# Altium schematic sheet DDR.SchDoc
size A4; SheetNumber: 3; SheetTotal: 9
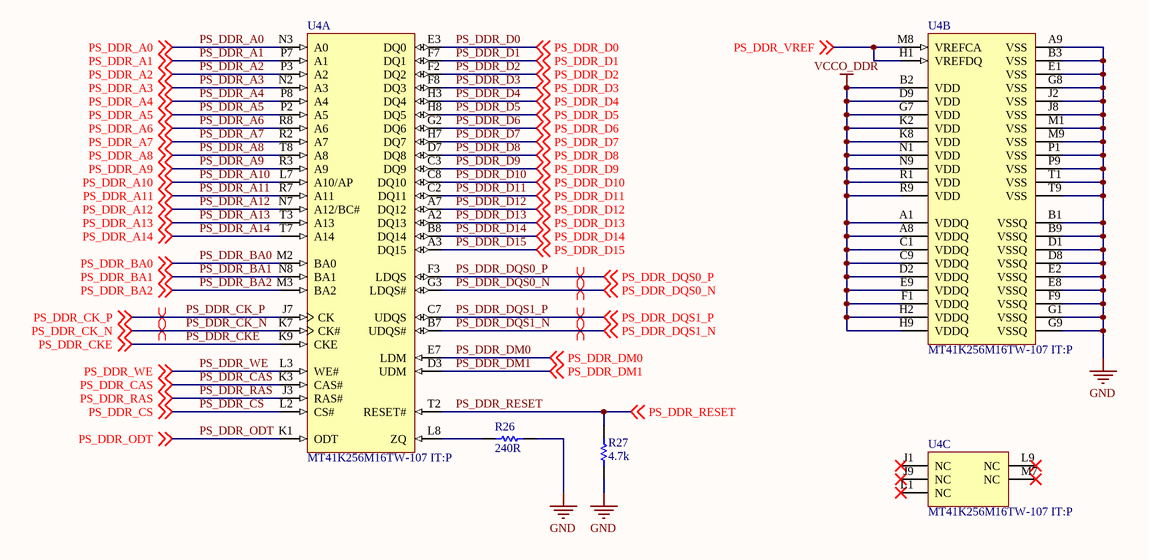
[diagram p0: DDR.SchDoc]

## Parts
R26  240R  [RESC0603(1608)_N]
R27  4.7k  [RESC1608X55X25LL10T15]
U4  MT41K256M16TW-107 IT:P  [MICT-TW-96]  (parts A,B,C of 3)

## Nets
GND: R26.2 R27.1 U4.A9(VSS) U4.B1(VSSQ) U4.B3(VSS) U4.B9(VSSQ) U4.D1(VSSQ) U4.D8(VSSQ) U4.E1(VSS) U4.E2(VSSQ) U4.E8(VSSQ) U4.F9(VSSQ) U4.G1(VSSQ) U4.G8(VSS) U4.G9(VSSQ) U4.J2(VSS) U4.J8(VSS) U4.M1(VSS) U4.M9(VSS) U4.P1(VSS) U4.P9(VSS) U4.T1(VSS) U4.T9(VSS)
VCCO_DDR: U4.A1(VDDQ) U4.A8(VDDQ) U4.B2(VDD) U4.C1(VDDQ) U4.C9(VDDQ) U4.D2(VDDQ) U4.D9(VDD) U4.E9(VDDQ) U4.F1(VDDQ) U4.G7(VDD) U4.H2(VDDQ) U4.H9(VDDQ) U4.K2(VDD) U4.K8(VDD) U4.N1(VDD) U4.N9(VDD) U4.R1(VDD) U4.R9(VDD)
PS_DDR_A0: U4.N3(A0) ; off-sheet PS_DDR_A0
PS_DDR_A1: U4.P7(A1) ; off-sheet PS_DDR_A1
PS_DDR_A2: U4.P3(A2) ; off-sheet PS_DDR_A2
PS_DDR_A3: U4.N2(A3) ; off-sheet PS_DDR_A3
PS_DDR_A4: U4.P8(A4) ; off-sheet PS_DDR_A4
PS_DDR_A5: U4.P2(A5) ; off-sheet PS_DDR_A5
PS_DDR_A6: U4.R8(A6) ; off-sheet PS_DDR_A6
PS_DDR_A7: U4.R2(A7) ; off-sheet PS_DDR_A7
PS_DDR_A8: U4.T8(A8) ; off-sheet PS_DDR_A8
PS_DDR_A9: U4.R3(A9) ; off-sheet PS_DDR_A9
PS_DDR_A10: U4.L7(A10/AP) ; off-sheet PS_DDR_A10
PS_DDR_A11: U4.R7(A11) ; off-sheet PS_DDR_A11
PS_DDR_A12: U4.N7(A12/BC#) ; off-sheet PS_DDR_A12
PS_DDR_A13: U4.T3(A13) ; off-sheet PS_DDR_A13
PS_DDR_A14: U4.T7(A14) ; off-sheet PS_DDR_A14
PS_DDR_BA0: U4.M2(BA0) ; off-sheet PS_DDR_BA0
PS_DDR_BA1: U4.N8(BA1) ; off-sheet PS_DDR_BA1
PS_DDR_BA2: U4.M3(BA2) ; off-sheet PS_DDR_BA2
PS_DDR_CAS: U4.K3(CAS#) ; off-sheet PS_DDR_CAS
PS_DDR_CK_N: U4.K7(CK#) ; off-sheet PS_DDR_CK_N
PS_DDR_CK_P: U4.J7(CK) ; off-sheet PS_DDR_CK_P
PS_DDR_CKE: U4.K9(CKE) ; off-sheet PS_DDR_CKE
PS_DDR_CS: U4.L2(CS#) ; off-sheet PS_DDR_CS
PS_DDR_D0: U4.E3(DQ0) ; off-sheet PS_DDR_D0
PS_DDR_D1: U4.F7(DQ1) ; off-sheet PS_DDR_D1
PS_DDR_D2: U4.F2(DQ2) ; off-sheet PS_DDR_D2
PS_DDR_D3: U4.F8(DQ3) ; off-sheet PS_DDR_D3
PS_DDR_D4: U4.H3(DQ4) ; off-sheet PS_DDR_D4
PS_DDR_D5: U4.H8(DQ5) ; off-sheet PS_DDR_D5
PS_DDR_D6: U4.G2(DQ6) ; off-sheet PS_DDR_D6
PS_DDR_D7: U4.H7(DQ7) ; off-sheet PS_DDR_D7
PS_DDR_D8: U4.D7(DQ8) ; off-sheet PS_DDR_D8
PS_DDR_D9: U4.C3(DQ9) ; off-sheet PS_DDR_D9
PS_DDR_D10: U4.C8(DQ10) ; off-sheet PS_DDR_D10
PS_DDR_D11: U4.C2(DQ11) ; off-sheet PS_DDR_D11
PS_DDR_D12: U4.A7(DQ12) ; off-sheet PS_DDR_D12
PS_DDR_D13: U4.A2(DQ13) ; off-sheet PS_DDR_D13
PS_DDR_D14: U4.B8(DQ14) ; off-sheet PS_DDR_D14
PS_DDR_D15: U4.A3(DQ15) ; off-sheet PS_DDR_D15
PS_DDR_DM0: U4.E7(LDM) ; off-sheet PS_DDR_DM0
PS_DDR_DM1: U4.D3(UDM) ; off-sheet PS_DDR_DM1
PS_DDR_DQS0_N: U4.G3(LDQS#) ; off-sheet PS_DDR_DQS0_N
PS_DDR_DQS0_P: U4.F3(LDQS) ; off-sheet PS_DDR_DQS0_P
PS_DDR_DQS1_N: U4.B7(UDQS#) ; off-sheet PS_DDR_DQS1_N
PS_DDR_DQS1_P: U4.C7(UDQS) ; off-sheet PS_DDR_DQS1_P
PS_DDR_ODT: U4.K1(ODT) ; off-sheet PS_DDR_ODT
PS_DDR_RAS: U4.J3(RAS#) ; off-sheet PS_DDR_RAS
PS_DDR_RESET: R27.2 U4.T2(RESET#) ; off-sheet PS_DDR_RESET
PS_DDR_VREF: U4.H1(VREFDQ) U4.M8(VREFCA) ; off-sheet PS_DDR_VREF
PS_DDR_WE: U4.L3(WE#) ; off-sheet PS_DDR_WE
NetR26_1: R26.1 U4.L8(ZQ)

Not connected (* = marked no-connect by the designer): U4 J1(NC)* J9(NC)* L1(NC)* L9(NC)* M7(NC)*

## Layout directives
differential pair: PS_DDR_CK_N, PS_DDR_CK_P, PS_DDR_DQS0_N, PS_DDR_DQS0_P, PS_DDR_DQS1_N, PS_DDR_DQS1_P

## Library data of the parts
R26 = CMP-1012-00438-1: 240R 0.1W 1% 0603 (1608 Metric)  SMD; Case-EIA: 0603; Value: 240.00 Ohm; Case-Metric: 1608; Technology: SMT; Power: 0.1 W; Tolerance: 1 %
R27 = CMP-2000-06942-1: Chip Resistor, 4.7 KOhm, +/- 1%, 0.1 W, -55 to 155 degC, 0603 (1608 Metric), RoHS, Tape and Reel; Manufacturer: Yageo; Power Rating: 100mW; Temperature Coefficient: 100PPM/C; Resistance: 4.7kOhms; Voltage Rating: 50V; Package Reference: 0603; Series: RC; Datasheet Version: Rev. 7, 05/2017; Packaging: Reel; Termination Style: SMD/SMT; Datasheet URL: http://www.yageo.com/documents/recent/PYu-RC_Group_51_RoHS_L_7.pdf; Manufacturer URL: http://www.yageo.com/; Package Description: 2-Pin Surface Mount Device, Body 1.6 x 0.8 mm; Case Code - mm: 1608; Case Code - in: 0603; Mounting Technology: SurfaceMount; Operating Temperature Range: -55Cto+155C; Tolerance: 1%; Product: ThickFilmResistorsGeneralPurpose
U4 = CMP-2000-06773-2: Automotive DDR3L SDRAM, 4 GB, 933 MHz, 1.283 to 1.45 V, -40 to 95 degC, 96-Pin TFBGA, RoHS, Tray; Manufacturer: Micron; Data Bus Width: 16b; Address Bus Width: 15b; Operating Supply Voltage: 1.35V; Access Time: 1.07ns; Max Frequency: 933MHz; Density: 4Gb; Package Reference: TW-96; Max Operating Temperature: 95degC; RoHSCompliant: true; Datasheet Version: Rev. D, 02/2017; Datasheet URL: https://www.micron.com/~/media/documents/products/data-sheet/dram/ddr3/4gb_automotive_ddr3l.pdf; Mount: SurfaceMount; Min Operating Temperature: -40degC; Package Description: 96-Ball Fine Pitch Ball Grid Array, Body 14 x 8 mm, Pitch 0.8 mm; Mounting Technology: SurfaceMount; Contact Plating: Silver; Manufacturer URL: http://www.micron.com/